# EAGLE design MI0283QT_v20 (EAGLE 6.6.0)
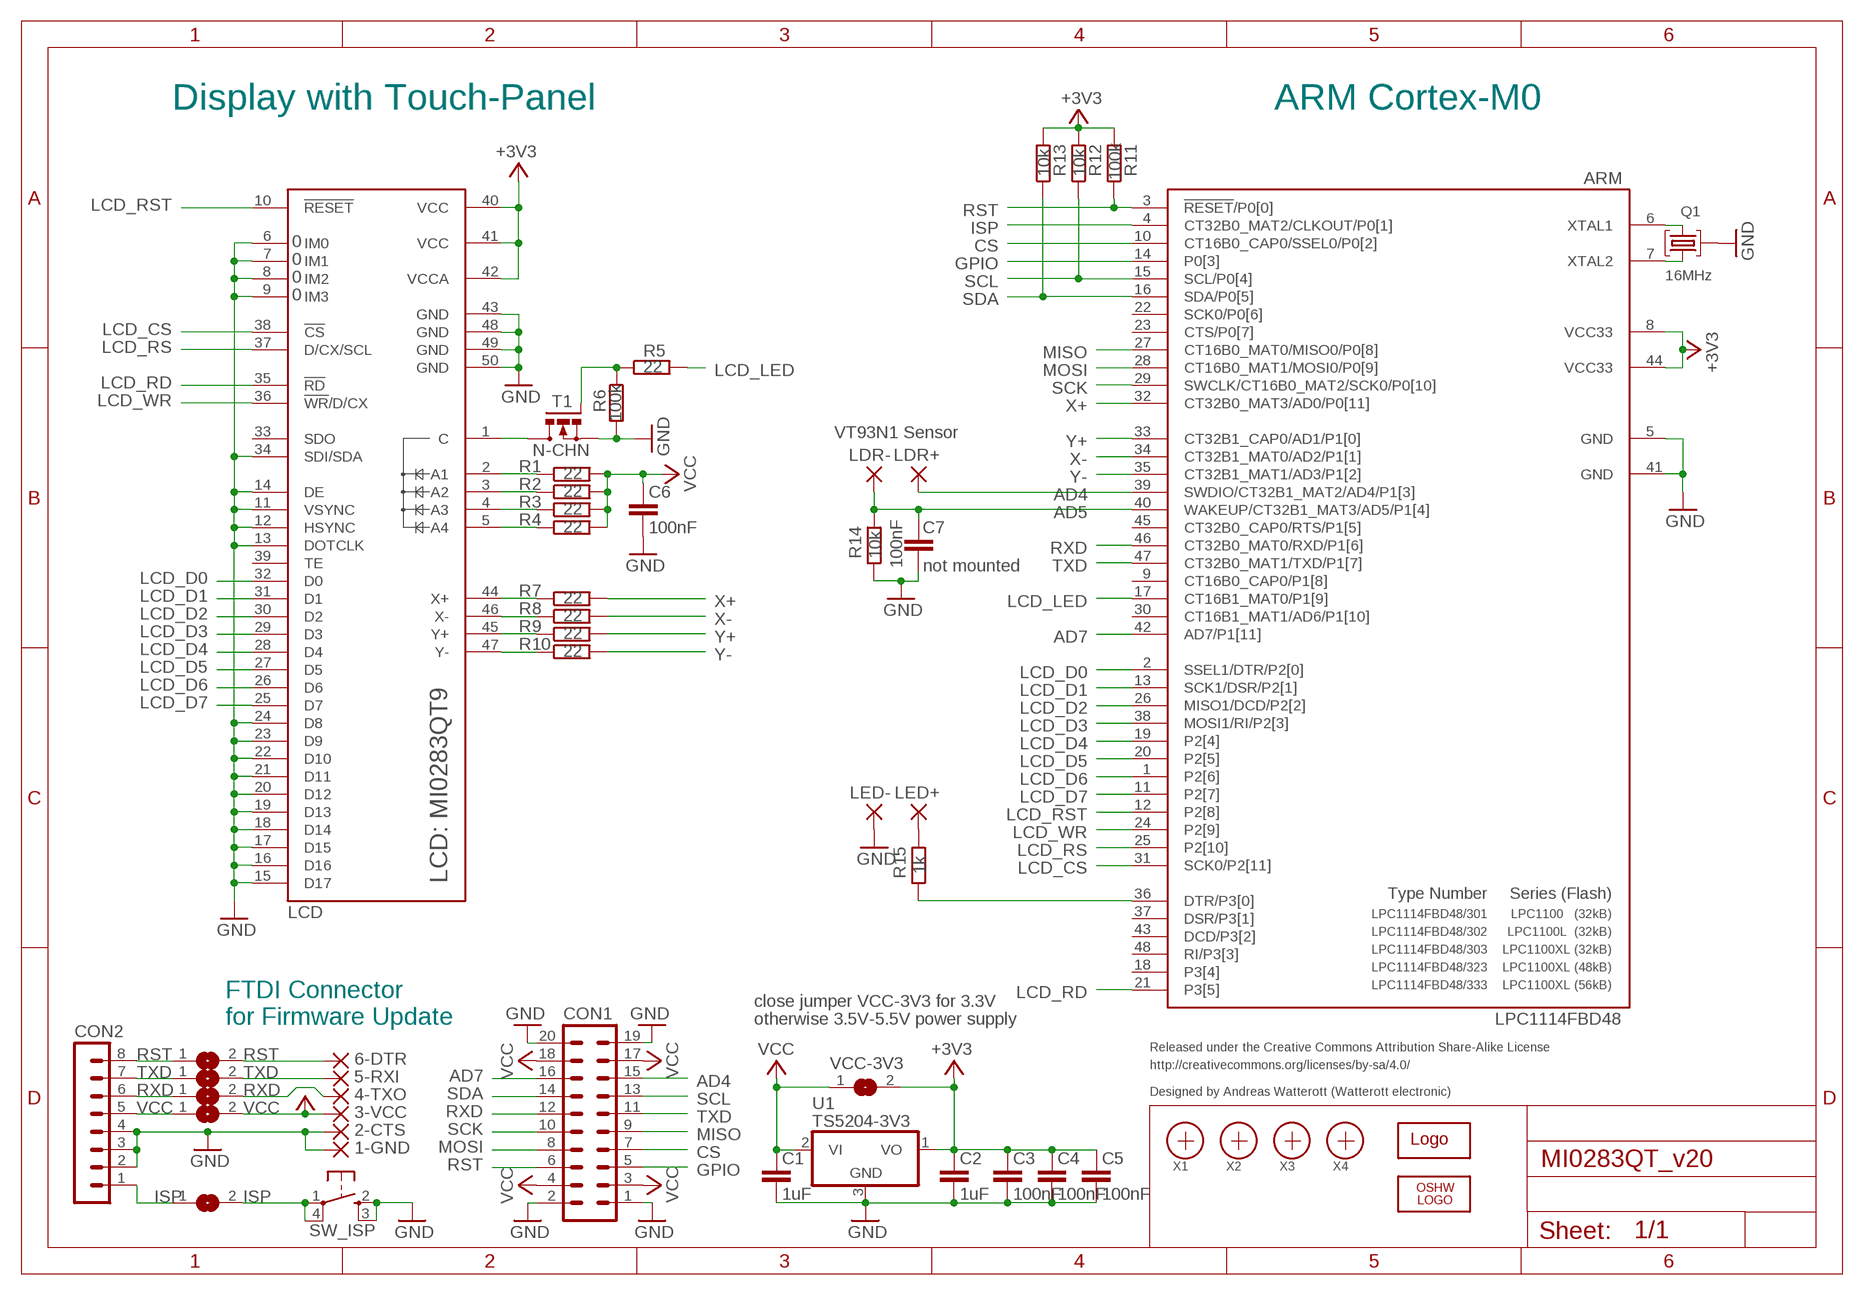
[diagram p0: schematic, sheet 1]

## Parts
1-GND  WIREPADSMD1,27-254  [SMD1,27-2,54]
2-CTS  WIREPADSMD1,27-254  [SMD1,27-2,54]
3-VCC  WIREPADSMD1,27-254  [SMD1,27-2,54]
4-TXO  WIREPADSMD1,27-254  [SMD1,27-2,54]
5-RXI  WIREPADSMD1,27-254  [SMD1,27-2,54]
6-DTR  WIREPADSMD1,27-254  [SMD1,27-2,54]
ARM  LPC1114FBD48  LPC111X  [LQFP48]
C1  1uF  C-EUC0603  [C0603]
C2  1uF  C-EUC0603  [C0603]
C3  100nF  C-EUC0603  [C0603]
C4  100nF  C-EUC0603  [C0603]
C5  100nF  C-EUC0603  [C0603]
C6  100nF  C-EUC0603  [C0603]
C7  100nF  C-EUC0603  [C0603]
CON1  MA10-2  [MA10-2]
CON2  MA08-1  [MA08-1]
ISP  SJ  [SJ]
LCD  MI0283QT9  [MI0283QT9]
LDR+  WIREPAD2,15/1,0  [2,15/1,0]
LDR-  WIREPAD2,15/1,0  [2,15/1,0]
LED+  WIREPAD2,15/1,0  [2,15/1,0]
LED-  WIREPAD2,15/1,0  [2,15/1,0]
LOGO1  OSHW_LOGO_6MILX0150-NT  [OSHW_6X150_NOTEXT]
Q1  16MHz  SMD_OSC2  [SMD_OSC_35X15]
R1  22  R-EU_R0603  [R0603]
R2  22  R-EU_R0603  [R0603]
R3  22  R-EU_R0603  [R0603]
R4  22  R-EU_R0603  [R0603]
R5  22  R-EU_R0603  [R0603]
R6  100k  R-EU_R0603  [R0603]
R7  22  R-EU_R0603  [R0603]
R8  22  R-EU_R0603  [R0603]
R9  22  R-EU_R0603  [R0603]
R10  22  R-EU_R0603  [R0603]
R11  100k  R-EU_R0603  [R0603]
R12  10k  R-EU_R0603  [R0603]
R13  10k  R-EU_R0603  [R0603]
R14  10k  R-EU_R0603  [R0603]
R15  1k  R-EU_R0603  [R0603]
RST  SJ  [SJ]
RXD  SJ  [SJ]
SW_ISP  SW_SMDS  [SW_SMD4@1]
T1  N-CHN  IRLML2502  [MICRO3]
TXD  SJ  [SJ]
U1  TS5204-3V3  TS5204  [SOT23]
U$1  WE-LOGO  WE-LOGOPLACE  [WE-LOGO]
VCC  SJ  [SJ]
VCC-3V3  SJ  [SJ]
X1  PASSER  [PASSER]
X2  PASSER  [PASSER]
X3  PASSER  [PASSER]
X4  PASSER  [PASSER]

## Nets
+3V3: ARM.8(VCC33) ARM.44(VCC33) C2.1 C3.1 C4.1 C5.1 LCD.40(VCC) LCD.41(VCC) LCD.42(VCCA) R11.2 R12.2 R13.2 U1.1(VO) VCC-3V3.2
AD4: ARM.39(SWDIO/CT32B1_MAT2/AD4/P1[3]) CON1.15 LDR+.1(P)
AD5: ARM.40(WAKEUP/CT32B1_MAT3/AD5/P1[4]) C7.1 LDR-.1(P) R14.2
AD7: ARM.42(AD7/P1[11]) CON1.16
C: LCD.1(C) T1.3(D)
C_ISP: CON2.1 ISP.1
C_RST: CON2.8 RST.1
C_RXD: CON2.6 RXD.1
C_TXD: CON2.7 TXD.1
C_VCC: CON2.5 VCC.1
CS: ARM.10(CT16B0_CAP0/SSEL0/P0[2]) CON1.7
GND: 1-GND.1(P) 2-CTS.1(P) ARM.5(GND) ARM.41(GND) C1.2 C2.2 C3.2 C4.2 C5.2 C6.2 C7.2 CON1.1 CON1.2 CON1.19 CON1.20 CON2.2 CON2.3 CON2.4 LCD.6(IM0) LCD.7(IM1) LCD.8(IM2) LCD.9(IM3) LCD.11(VSYNC) LCD.12(HSYNC) LCD.13(DOTCLK) LCD.14(DE) LCD.15(D17) LCD.16(D16) LCD.17(D15) LCD.18(D14) LCD.19(D13) LCD.20(D12) LCD.21(D11) LCD.22(D10) LCD.23(D9) LCD.24(D8) LCD.34(SDI/SDA) LCD.43(GND) LCD.48(GND) LCD.49(GND) LCD.50(GND) LED-.1(P) Q1.GND R6.2 R14.1 SW_ISP.2(S) SW_ISP.3(S1) T1.2(S) U1.3(GND)
GPIO: ARM.14(P0[3]) CON1.5
ISP: ARM.4(CT32B0_MAT2/CLKOUT/P0[1]) ISP.2 SW_ISP.1(P) SW_ISP.4(P1)
LCD_CS: ARM.31(SCK0/P2[11]) LCD.38(!CS)
LCD_D0: ARM.2(SSEL1/DTR/P2[0]) LCD.32(D0)
LCD_D1: ARM.13(SCK1/DSR/P2[1]) LCD.31(D1)
LCD_D2: ARM.26(MISO1/DCD/P2[2]) LCD.30(D2)
LCD_D3: ARM.38(MOSI1/RI/P2[3]) LCD.29(D3)
LCD_D4: ARM.19(P2[4]) LCD.28(D4)
LCD_D5: ARM.20(P2[5]) LCD.27(D5)
LCD_D6: ARM.1(P2[6]) LCD.26(D6)
LCD_D7: ARM.11(P2[7]) LCD.25(D7)
LCD_LED: ARM.17(CT16B1_MAT0/P1[9]) R5.2
LCD_RD: ARM.21(P3[5]) LCD.35(!RD)
LCD_RS: ARM.25(P2[10]) LCD.37(D/CX/SCL)
LCD_RST: ARM.12(P2[8]) LCD.10(!RESET)
LCD_WR: ARM.24(P2[9]) LCD.36(!WR!/D/CX)
LED: ARM.36(DTR/P3[0]) R15.1
LED_A1: LCD.2(A1) R1.1
LED_A2: LCD.3(A2) R2.1
LED_A3: LCD.4(A3) R3.1
LED_A4: LCD.5(A4) R4.1
LEDPWM: R5.1 R6.1 T1.1(G)
MISO: ARM.27(CT16B0_MAT0/MISO0/P0[8]) CON1.9
MOSI: ARM.28(CT16B0_MAT1/MOSI0/P0[9]) CON1.8
N$1: ARM.6(XTAL1) Q1.2
N$2: ARM.7(XTAL2) Q1.1
N$8: LED+.1(P) R15.2
RST: 6-DTR.1(P) ARM.3(!RESET!/P0[0]) CON1.6 R11.1 RST.2
RXD: 4-TXO.1(P) ARM.46(CT32B0_MAT0/RXD/P1[6]) CON1.12 RXD.2
SCK: ARM.29(SWCLK/CT16B0_MAT2/SCK0/P0[10]) CON1.10
SCL: ARM.15(SCL/P0[4]) CON1.13 R12.1
SDA: ARM.16(SDA/P0[5]) CON1.14 R13.1
TXD: 5-RXI.1(P) ARM.47(CT32B0_MAT1/TXD/P1[7]) CON1.11 TXD.2
VCC: 3-VCC.1(P) C1.1 C6.1 CON1.3 CON1.4 CON1.17 CON1.18 R1.2 R2.2 R3.2 R4.2 U1.2(VI) VCC-3V3.1 VCC.2
X+: ARM.32(CT32B0_MAT3/AD0/P0[11]) R7.2
X-: ARM.34(CT32B1_MAT0/AD2/P1[1]) R8.2
XM: LCD.46(X-) R8.1
XP: LCD.44(X+) R7.1
Y+: ARM.33(CT32B1_CAP0/AD1/P1[0]) R9.2
Y-: ARM.35(CT32B1_MAT1/AD3/P1[2]) R10.2
YM: LCD.47(Y-) R10.1
YP: LCD.45(Y+) R9.1
Unconnected: ARM.9(CT16B0_CAP0/P1[8]) ARM.18(P3[4]) ARM.22(SCK0/P0[6]) ARM.23(CTS/P0[7]) ARM.30(CT16B1_MAT1/AD6/P1[10]) ARM.37(DSR/P3[1]) ARM.43(DCD/P3[2]) ARM.45(CT32B0_CAP0/RTS/P1[5]) ARM.48(RI/P3[3]) LCD.33(SDO) LCD.39(TE)

## Notes on the sheet
- Display with Touch-Panel | ARM Cortex-M0
- 0
- 0
- 0
- 0
- VT93N1 Sensor
- not mounted
- Type Number | Series (Flash)
- LPC1114FBD48/301 | LPC1100   (32kB)
- LPC1114FBD48/302 | LPC1100L  (32kB)
- LPC1114FBD48/303 | LPC1100XL (32kB)
- LPC1114FBD48/323 | LPC1100XL (48kB)
- LPC1114FBD48/333 | LPC1100XL (56kB)
- FTDI Connector
- close jumper VCC-3V3 for 3.3V
- for Firmware Update | otherwise 3.5V-5.5V power supply
- Released under the Creative Commons Attribution Share-Alike License
- http://creativecommons.org/licenses/by-sa/4.0/
- Designed by Andreas Watterott (Watterott electronic)

## Library data of the parts
1-GND 2-CTS 3-VCC 4-TXO 5-RXI 6-DTR LDR+ LDR- LED+ LED- = wirepad:WIREPAD: Wire PAD connect wire on PCB
ARM = ARM:LPC111X: NXP LPC1113/14
C1-C7 = rcl:C-EU: CAPACITOR, European symbol
CON1 = con-lstb:MA10-2: PIN HEADER; OC_FARNELL: unknown; OC_NEWARK: unknown
CON2 = con-lstb:MA08-1: PIN HEADER; OC_FARNELL: unknown; OC_NEWARK: unknown
ISP RST RXD TXD VCC VCC-3V3 = jumper:SJ: SMD solder JUMPER
LCD = Display:MI0283QT9: Multi-Inno MIO283QT9 LCD (240x320) with Ilitek ILI9341 controller
LOGO1 = OSHW:OSHW_LOGO_6MIL
Q1 = Crystal:SMD_OSC
R1-R15 = rcl:R-EU_: RESISTOR, European symbol
SW_ISP = Switch-SMD:SW_SMD
T1 = IRF-sot23:IRLML2502: N-Channel Power MOSFET
U1 = Voltage-Reg:TS5204
U$1 = welectronic:WE-LOGO
X1-X4 = SMD:PASSER

## Board
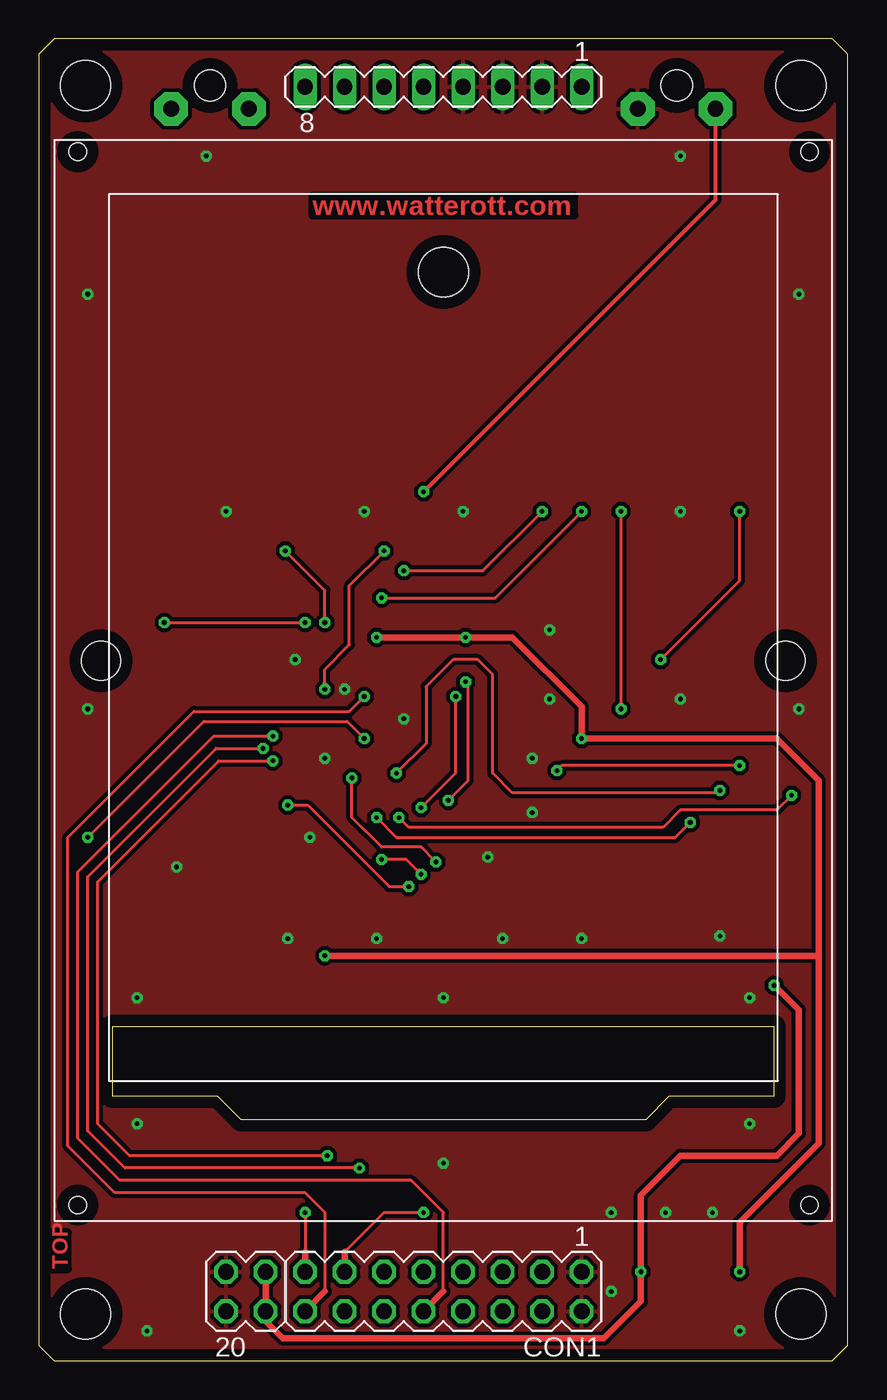
[diagram p1: board, top side]
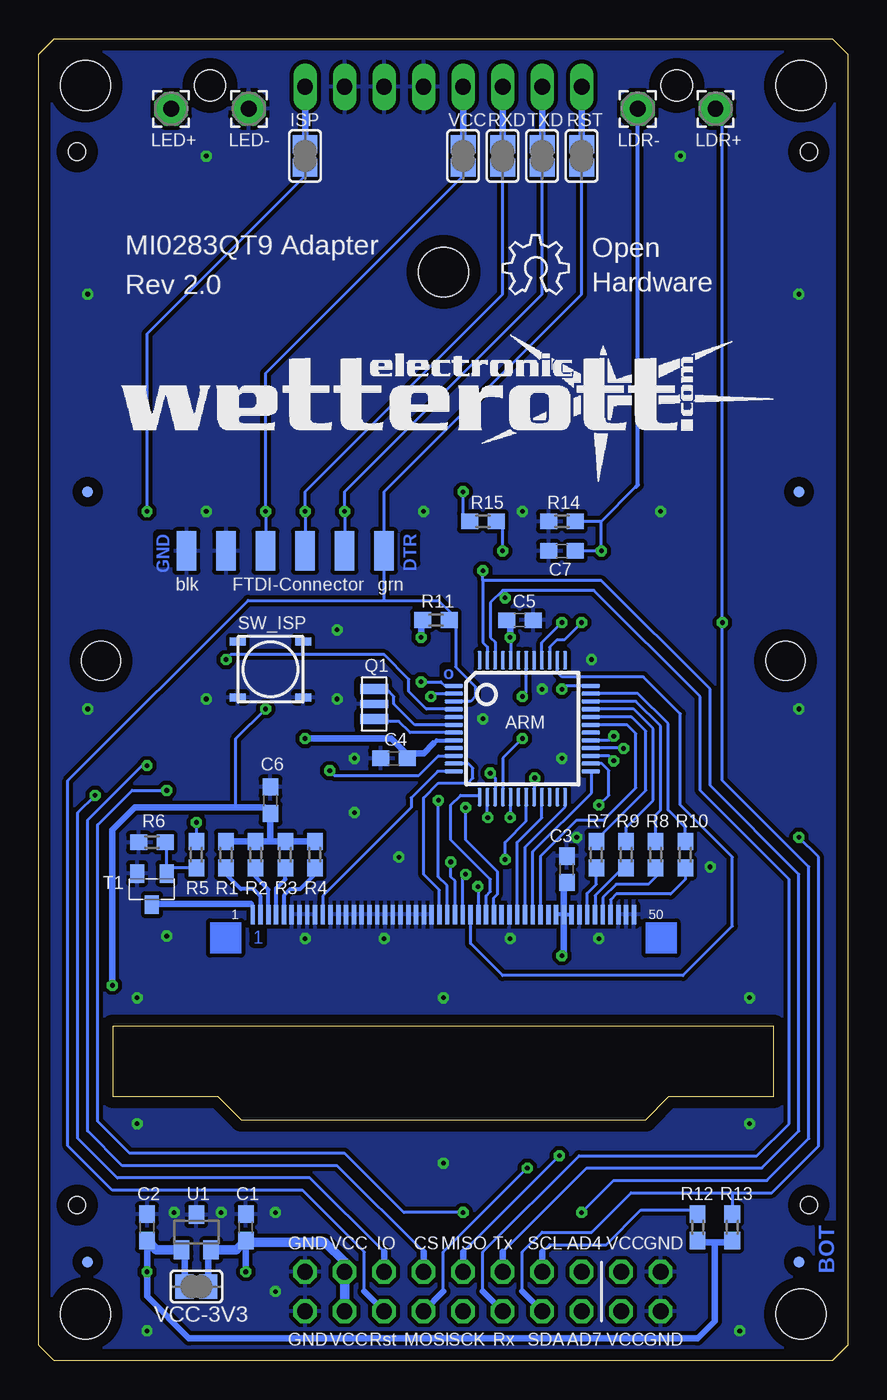
[diagram p2: board, bottom side, seen from below]

Size 52 x 85 mm. Coordinates in mm from the lower left corner, seen from the top.
Outline: 0,1 1,0 51,0 52,1 52,84 51,85 1,85 0,84 0,1
Copper layers (1*16): Top 0.035mm / dielectric 1.5mm / Bottom 0.035mm
Design rules "default *": minimum track width 8mil, minimum drill 0.3mm, track to track 8mil, track to pad 8mil, pad to pad 8mil, via to via 8mil, smd to smd 8mil, copper to edge 30mil, drill to drill 8mil, minimum pad ring 10mil, minimum via ring 8mil, stop-mask expansion 4mil, vias tented up to drill 0.5mm, thermal gap 10mil
Holes 3.2 mm at 3,3 49,3 3,82 49,82 26,70
Holes 2 mm at 41,82 11,82
Holes 2.5 mm at 4,45 48,45
bRestrict: area 29.7,42.9 to 31.4,43.7; area 29.7,40.8 to 31.4,41.6

### Footprints (pad centres in the part's own frame; a part is rotated, then mirrored left to right if it is on the bottom)
SMD1,27-2,54 = smd 1.27 x 2.54: 1 0,0
LQFP48 = smd 1.2 x 0.26: 1 -4.4,2.75; 2 -4.4,2.25; 3 -4.4,1.75; 4 -4.4,1.25; 5 -4.4,0.75; 6 -4.4,0.25; 7 -4.4,-0.25; 8 -4.4,-0.75; 9 -4.4,-1.25; 10 -4.4,-1.75; 11 -4.4,-2.25; 12 -4.4,-2.75; 25 4.4,-2.75; 26 4.4,-2.25; 27 4.4,-1.75; 28 4.4,-1.25; 29 4.4,-0.75; 30 4.4,-0.25; 31 4.4,0.25; 32 4.4,0.75; 33 4.4,1.25; 34 4.4,1.75; 35 4.4,2.25; 36 4.4,2.75 | smd 0.26 x 1.2: 13 -2.75,-4.4; 14 -2.25,-4.4; 15 -1.75,-4.4; 16 -1.25,-4.4; 17 -0.75,-4.4; 18 -0.25,-4.4; 19 0.25,-4.4; 20 0.75,-4.4; 21 1.25,-4.4; 22 1.75,-4.4; 23 2.25,-4.4; 24 2.75,-4.4; 37 2.75,4.4; 38 2.25,4.4; 39 1.75,4.4; 40 1.25,4.4; 41 0.75,4.4; 42 0.25,4.4; 43 -0.25,4.4; 44 -0.75,4.4; 45 -1.25,4.4; 46 -1.75,4.4; 47 -2.25,4.4; 48 -2.75,4.4
C0603 = smd 1.1 x 1: 1 -0.85,0; 2 0.85,0
MA10-2 = drill 1.016 octagon: 1 -11.43,-1.27; 2 -11.43,1.27; 3 -8.89,-1.27; 4 -8.89,1.27; 5 -6.35,-1.27; 6 -6.35,1.27; 7 -3.81,-1.27; 8 -3.81,1.27; 9 -1.27,-1.27; 10 -1.27,1.27; 11 1.27,-1.27; 12 1.27,1.27; 13 3.81,-1.27; 14 3.81,1.27; 15 6.35,-1.27; 16 6.35,1.27; 17 8.89,-1.27; 18 8.89,1.27; 19 11.43,-1.27; 20 11.43,1.27
MA08-1 = drill 1.016 long: 1 -8.89,0; 2 -6.35,0; 3 -3.81,0; 4 -1.27,0; 5 1.27,0; 6 3.81,0; 7 6.35,0; 8 8.89,0
SJ = smd 1.168 x 1.6: 1 -0.762,0; 2 0.762,0
MI0283QT9 = smd 0.279 x 1.27 bottom: 1 12.25,19.683; 2 11.75,19.683; 3 11.25,19.683; 4 10.75,19.683; 5 10.25,19.683; 6 9.75,19.683; 7 9.25,19.683; 8 8.75,19.683; 9 8.25,19.683; 10 7.75,19.683; 11 7.25,19.683; 12 6.75,19.683; 13 6.25,19.683; 14 5.75,19.683; 15 5.25,19.683; 16 4.75,19.683; 17 4.25,19.683; 18 3.75,19.683; 19 3.25,19.683; 20 2.75,19.683; 21 2.25,19.683; 22 1.75,19.683; 23 1.25,19.683; 24 0.75,19.683; 25 0.25,19.683; 26 -0.25,19.683; 27 -0.75,19.683; 28 -1.25,19.683; 29 -1.75,19.683; 30 -2.25,19.683; 31 -2.75,19.683; 32 -3.25,19.683; 33 -3.75,19.683; 34 -4.25,19.683; 35 -4.75,19.683; 36 -5.25,19.683; 37 -5.75,19.683; 38 -6.25,19.683; 39 -6.75,19.683; 40 -7.25,19.683; 41 -7.75,19.683; 42 -8.25,19.683; 43 -8.75,19.683; 44 -9.25,19.683; 45 -9.75,19.683; 46 -10.25,19.683; 47 -10.75,19.683; 48 -11.25,19.683; 49 -11.75,19.683; 50 -12.25,19.683 | hole 1.1: 23.54,1; -23.5,1; 23.54,68.75; -23.5,68.75
2,15/1,0 = drill 1.016 pad 2.159 octagon: 1 0,0
SMD_OSC_35X15 = smd 0.635 x 1.778: 1 -0.965,0; 2 0.965,0 | smd 0.508 x 1.778: GND 0,0
R0603 = smd 1.1 x 1: 1 -0.85,0; 2 0.85,0
SW_SMD4@1 = smd 0.508 x 1.016: 1 -1.8,-2.1; 2 1.8,-2.1; 3 1.8,2.1; 4 -1.8,2.1
MICRO3 = smd 0.9 x 1.2: 1 -0.95,-1; 2 0.95,-1; 3 0,1
SOT23 = smd 1 x 1.2: 1 -0.95,-1.132; 2 0.95,-1.132; 3 0,1.132
PASSER = smd 0.7 x 0.7: X 0,0

### Placement (x,y rotation side)
1-GND  42.51,52.07 0 bottom
2-CTS  39.97,52.07 0 bottom
3-VCC  37.43,52.07 0 bottom
4-TXO  34.89,52.07 0 bottom
5-RXI  32.35,52.07 0 bottom
6-DTR  29.81,52.07 0 bottom
ARM  20.92,40.64 0 bottom
C1  38.7,8.57 90 bottom
C2  45.05,8.57 90 bottom
C3  18.06,31.59 90 bottom
C4  29.18,38.73 180 bottom
C5  21.08,47.62 0 bottom
C6  37.11,36.04 90 bottom
C7  18.38,52.07 180 bottom
CON1  23.46,4.45 180 top
CON2  26,81.92 180 top
ISP  34.89,77.47 270 bottom
LCD  26,9 0 top
LDR+  8.5,80.5 0 bottom
LDR-  13.5,80.5 0 bottom
LED+  43.5,80.5 0 bottom
LED-  38.5,80.5 0 bottom
LOGO1  22.19,68.58 0 bottom
Q1  30.45,42.23 90 bottom
R1  39.97,32.54 90 bottom
R2  38.06,32.54 90 bottom
R3  36.16,32.54 90 bottom
R4  34.26,32.54 90 bottom
R5  41.88,32.54 90 bottom
R6  44.73,33.34 180 bottom
R7  16.16,32.54 90 bottom
R8  12.35,32.54 90 bottom
R9  14.25,32.54 90 bottom
R10  10.44,32.54 90 bottom
R11  26.48,47.63 180 bottom
R12  9.65,8.57 270 bottom
R13  7.43,8.57 270 bottom
R14  18.38,53.98 0 bottom
R15  23.46,53.98 180 bottom
RST  17.11,77.47 270 bottom
RXD  22.19,77.47 270 bottom
SW_ISP  37.11,44.45 270 bottom
T1  44.73,30.32 180 bottom
TXD  19.65,77.47 270 bottom
U1  41.88,8.26 0 bottom
U$1  46.95,56.2 0 bottom
VCC  24.73,77.47 270 bottom
VCC-3V3  41.88,4.76 180 bottom
X1  3.14,6.35 0 bottom
X2  3.14,55.88 0 bottom
X3  48.86,55.88 0 bottom
X4  48.86,6.35 0 bottom

### Tracks (layer width: path | path; a pad name or v marks a point on that pad's centre or on a via)
+3V3  (via drill 0.3)
  Top 0.406: v45.05,5.71 45.05,8.89 50.13,13.97 50.13,26.04 | v21.71,46.51 v27.43,46.51 30.45,46.51 34.89,42.07 v34.89,40.01 | 50.13,26.04 v18.38,26.04 | 50.13,26.04 50.13,37.31 47.43,40.01 v34.89,40.01 | v34.89,40.01
  Bottom 0.203: 45.03,7.12 45.05,7.14 C2.1 | 28.38,38.73 C4.1 | 21.67,46.47 ARM.44 | 21.71,47.41 C5.1
  Bottom 0.254: LCD.42 LCD.41 LCD.40 | ARM.8 26.43,39.89 26.64,39.69
  Bottom 0.406: 42.64,6.93 VCC-3V3.2 | 45.05,7.14 v45.05,5.71 45.05,4.13 42.35,1.43 9.65,1.43 8.54,2.54 8.54,7.62 | 28.38,39.05 28.38,38.73 | 28.38,39.05 29.33,40.01 v34.89,40.01 | 28.38,39.05 27.27,39.05 26.64,39.69 | v18.38,26.04 18.25,26.16 LCD.41 18.25,30.55 C3.1 | 21.67,46.47 v21.71,46.51 21.71,47.41 | 8.54,7.62 7.53,7.62 R13.2 | 8.54,7.62 9.55,7.62 R12.2 | v27.43,46.51 27.43,47.52 R11.2 | v34.89,40.01
  Bottom 0.61: 42.64,6.93 U1.1 44.45,7.12 C2.1
AD4  (via drill 0.3)
  Top 0.203: v17.11,9.53 17.11,6.99 | v8.06,47.47 v17.11,47.47
  Top 0.406: 17.11,6.99 CON1.15
  Bottom 0.203: ARM.39 19.17,45.88 18.7,46.35 18.22,46.35 v17.11,47.47 | v17.11,9.53 15.05,11.59 5.2,11.59 2.5,14.29 2.5,31.75 | 2.5,31.75 | LDR+.1 8.06,80.06 v8.06,47.47 8.06,37.31 2.5,31.75 | 2.5,31.75
AD5  (via drill 0.3)
  Top 0.203: v18.38,47.47 18.38,49.53 v15.84,52.07
  Bottom 0.203: 15.84,53.98 v15.84,52.07 C7.1 | 15.84,53.98 13.62,56.2 | 15.84,53.98 R14.2 | ARM.40 19.67,46.18 v18.38,47.47 | v18.38,47.47
  Bottom 0.254: 13.62,56.2 13.5,56.31 LDR-.1
AD7  (via drill 0.3)
  Top 0.203: 18.38,4.45 18.38,9.53 17.11,10.79 4.89,10.79 1.87,13.81 1.87,33.66 9.97,41.75 19.97,41.75 v20.92,42.7
  Top 0.406: CON1.16 | 18.38,4.45 CON1.16
  Bottom 0.203: ARM.42 20.67,42.95 v20.92,42.7
C
  Bottom 0.254: LCD.1 38.25,29.24 38.38,29.37
  Bottom 0.406: 38.38,29.37 44.69,29.37 T1.3
C_ISP
  Bottom 0.203: ISP.1
  Bottom 0.406: ISP.1 CON2.1
C_RST
  Bottom 0.406: RST.1 CON2.8
C_RXD
  Bottom 0.406: RXD.1 CON2.6
C_TXD
  Bottom 0.203: CON2.7
  Bottom 0.406: TXD.1 CON2.7
C_VCC
  Bottom 0.406: VCC.1 CON2.5
CS  (via drill 0.3)
  Top 0.203: v33.3,37.94 33.62,38.26 v45.05,38.26
  Bottom 0.203: ARM.10 26.32,38.89 27.59,37.62 32.98,37.62 v33.3,37.94 | 27.27,6.99 32.83,12.54 46.64,12.54 48.86,14.76 48.86,34.77 45.37,38.26 v45.05,38.26
  Bottom 0.406: CON1.7 27.27,6.99
GND  (via drill 0.3)
  other vias: 3.14,41.91 48.86,41.91 10.76,77.47 41.24,77.47 29.81,27.15 34.89,27.15 19.65,43.18 23.46,41.28 6.95,1.91 45.05,1.91 40.29,9.53 43.3,9.53 18.38,38.74 31.71,38.74 16,27.15 21.71,27.15 17.43,33.66 28.86,32.38 36.8,4.45 36.8,9.53 6.32,15.24 45.69,15.24 26,12.7 6.32,23.34 26,23.34 45.69,23.34 43.78,27.3 32.83,42.55 41.24,42.55 8.86,31.75 16.48,45.08 3.14,68.58 48.86,68.58 41.24,54.61 12.03,54.61 31.71,35.24 20.92,54.61 27.27,54.61 32.83,46.99
  pour Bottom (isolate 0.254): 0,85 52,85 52,0 0,0
  pour Top (isolate 0.254): 0,85 52,85 52,0 0,0
GPIO  (via drill 0.3)
  Top 0.203: v23.14,34.92 23.78,34.29 40.13,34.29 41.24,35.4 47.43,35.4 v48.38,36.35
  Bottom 0.203: ARM.14 23.17,34.95 v23.14,34.92 | 29.81,6.99 34.57,11.75 46.95,11.75 49.5,14.29 49.5,35.24 v48.38,36.35 | v48.38,36.35
  Bottom 0.406: CON1.5 29.81,6.99
ISP  (via drill 0.3)
  Top 0.203: v45.05,54.61 45.05,50.16 v39.97,45.09
  Bottom 0.203: ARM.4 27.09,41.89 28.22,43.02 28.22,43.81 29.81,45.4 35.05,45.4 | 35.05,45.4 39.18,45.4 | v45.05,54.61 45.05,66.04 34.89,76.2 ISP.2 | ISP.2 | SW_ISP.4 35.01,46.23 35.05,46.2 35.05,45.4 | SW_ISP.1 39.21,46.23 39.18,46.2 39.18,45.4 | 39.18,45.4 39.65,45.4 v39.97,45.09
LCD_CS
  Bottom 0.203: ARM.31 14.19,40.89 13.62,40.32 13.62,36.83 15.68,34.77 17.43,34.77 19.75,32.44 LCD.38
LCD_D0  (via drill 0.3)
  Top 0.203: v26.79,42.7 | v26.79,42.7 26.79,37.78 v24.57,35.56
  Bottom 0.203: ARM.2 26.61,42.89 v26.79,42.7 | LCD.32 22.75,29.76 22.51,30 22.51,31.43 24.57,33.5 v24.57,35.56 | v24.57,35.56
LCD_D1
  Bottom 0.203: LCD.31 23.25,29.9 22.98,30.16 22.98,30.96 25.52,33.5 25.52,35.72 24.89,36.35 23.78,36.35 ARM.13
LCD_D2  (via drill 0.3)
  Top 0.203: v23.78,30.48 22.51,30.48 17.27,35.72 v16,35.72
  Bottom 0.203: ARM.26 15.81,38.39 15.36,37.94 15.36,36.35 v16,35.72 | LCD.30 23.75,30.45 v23.78,30.48
LCD_D3
  Bottom 0.203: LCD.29 24.25,26.82 22.19,24.77 10.6,24.77 7.43,27.94 7.43,32.38 10.76,35.72 10.76,41.59 13.14,43.97 18.38,43.97 18.67,44.26 ARM.38
LCD_D4  (via drill 0.3)
  Top 0.203: v22.03,32.23 23.62,32.23 v24.57,31.27
  Bottom 0.203: LCD.28 24.75,31.09 v24.57,31.27 | v22.03,32.23 22.03,33.34 20.67,34.7 ARM.19
LCD_D5  (via drill 0.3)
  Top 0.203: v25.52,32.07 24.57,33.02 22.03,33.02 20.13,34.92 v20.13,37.47 | v20.13,37.47
  Bottom 0.203: LCD.27 25.25,30.84 25.52,31.11 v25.52,32.07 | ARM.20 20.17,37.42 v20.13,37.47
LCD_D6  (via drill 0.3)
  Top 0.203: v27.43,43.66 27.59,43.5 27.59,37.31 v26.32,36.04 | v27.43,43.66
  Bottom 0.203: v26.32,36.04 26.32,31.11 25.75,30.55 LCD.26 | ARM.1 25.89,43.39 26.16,43.66 v27.43,43.66
LCD_D7
  Bottom 0.203: ARM.11 24.39,38.39 24.09,38.1 24.09,37.47 24.41,37.15 26.32,37.15 27.27,36.2 27.27,31.27 26.25,30.25 LCD.25
LCD_LED  (via drill 0.3)
  Top 0.203: v21.71,34.92 22.98,33.66 40.92,33.66 v41.88,34.61
  Bottom 0.203: ARM.17 21.67,34.97 v21.71,34.92 | 41.98,33.5 R5.2 v41.88,34.61 | v41.88,34.61
  Bottom 0.254: 41.98,33.5 41.88,33.5 | 41.88,33.5
LCD_RD
  Bottom 0.203: ARM.21 19.67,34.91 21.25,33.33 LCD.35
LCD_RS
  Bottom 0.203: ARM.25 16.48,37.84 16.48,36.51 20.25,32.74 LCD.37
LCD_RST
  Bottom 0.203: ARM.12 26.37,37.89 28.06,36.2 28.06,35.56 33.75,29.87 LCD.10
LCD_WR
  Bottom 0.203: ARM.24 18.17,35.61 20.75,33.03 LCD.36
LED  (via drill 0.3)
  Top 0.203: v18.38,43.18 18.38,44.45 19.97,46.04 19.97,49.85 v22.19,52.07
  Bottom 0.203: v22.19,52.07 22.19,53.55 R15.1 | ARM.36 18.17,43.39 v18.38,43.18
LED_A1
  Bottom 0.254: LCD.2 37.75,29.85 38.22,30.32 39.02,30.32 39.97,31.27 R1.1
LED_A2
  Bottom 0.254: LCD.3 37.25,30.3 38.06,31.11 R2.1
LED_A3
  Bottom 0.254: R3.1 36.16,30.96 36.75,30.37 LCD.4
LED_A4
  Bottom 0.254: R4.1 34.26,31.27 35.21,30.32 35.84,30.32 36.25,29.91 LCD.5
LEDPWM
  Bottom 0.203: R5.1 43.41,31.69 T1.1 43.78,33.24 R6.1
MISO  (via drill 0.3)
  Top 0.203: v18.54,13.18 5.84,13.18 3.77,15.24 3.77,30.8 11.55,38.58 v15.05,38.58 | v15.05,38.58
  Bottom 0.203: ARM.27 15.36,38.89 v15.05,38.58 | 24.73,6.99 v18.54,13.18
  Bottom 0.406: CON1.9 24.73,6.99
MOSI  (via drill 0.3)
  Top 0.203: v14.41,39.37 11.39,39.37 3.14,31.11 3.14,14.76 5.52,12.38 v20.6,12.38
  Bottom 0.203: ARM.28 14.43,39.39 v14.41,39.37 | 26,4.45 26,6.99 v20.6,12.38
  Bottom 0.406: 26,4.45 | CON1.8 26,4.45
N$1
  Bottom 0.203: ARM.6 27.84,40.89 29.18,42.23 29.18,42.7 29.65,43.18 30.43,43.18 Q1.2
N$2
  Bottom 0.203: ARM.7 28.13,40.39 28.86,41.12 30.3,41.12 Q1.1
N$8  (via drill 0.3)
  Top 0.254: v24.73,55.88 43.5,74.65 LED+.1
  Bottom 0.203: R15.2 24.73,53.98 | 24.73,53.98 | 24.73,53.98 v24.73,55.88
RST
  Bottom 0.203: 31.08,4.45 31.08,6.99 35.05,10.95 47.27,10.95 50.13,13.81 50.13,37.31 38.54,48.9 29.81,48.9 | ARM.3 24.25,42.39 23.94,42.7 23.94,43.34 25.21,44.61 25.21,47.2 R11.1 25.47,47.78 25.47,48.05 26.32,48.9 29.81,48.9 | RST.2 17.11,68.58 29.81,55.88 6-DTR.1 29.81,48.9
  Bottom 0.406: 31.08,4.45 | CON1.6 31.08,4.45
RXD  (via drill 0.3)
  Top 0.203: v22.03,49.05 29.33,49.05 v34.89,54.61
  Bottom 0.203: 3.77,15.24 3.77,30.96 9.49,36.67 9.49,42.7 16.32,49.53 22.03,49.53 | ARM.46 22.67,46.2 22.98,46.51 22.98,48.74 22.19,49.53 22.03,49.53 | 34.89,53.34 4-TXO.1 v34.89,54.61 34.89,55.88 22.19,68.58 RXD.2 | 3.77,15.24 | 3.77,15.24 5.84,13.18 17.27,13.18 23.46,6.99 23.46,4.45 | 22.03,49.53 v22.03,49.05
  Bottom 0.406: 23.46,4.45 | CON1.12 23.46,4.45
SCK  (via drill 0.3)
  Top 0.203: v15.05,40.16 11.24,40.16 2.5,31.43 2.5,14.29 5.2,11.59 23.94,11.59 26,9.53 26,4.45
  Top 0.406: CON1.10 | CON1.10 26,4.45
  Bottom 0.203: ARM.29 15.32,39.89 v15.05,40.16
SCL  (via drill 0.3)
  Top 0.203: v22.98,37.78 | v22.98,37.78 24.89,39.69 24.89,43.34 26.64,45.09 28.22,45.09 29.18,44.13 29.18,37.78 30.45,36.51 43.62,36.51 v43.78,36.67 | 19.65,6.99 22.19,9.53 v24.73,9.53
  Top 0.406: CON1.13 19.65,6.99
  Bottom 0.203: ARM.15 22.67,37.47 v22.98,37.78 | 19.65,6.99 19.17,7.46 15.52,7.46 13.3,9.68 9.91,9.68 R12.1 | v24.73,9.53 28.54,9.53 32.35,13.34 46.16,13.34 48.23,15.4 48.23,34.45 46,36.67 v43.78,36.67 | v43.78,36.67
  Bottom 0.406: CON1.13 19.65,6.99
SDA  (via drill 0.3)
  Top 0.203: v3.14,33.66 10.6,41.12 19.81,41.12 v20.92,40.01
  Bottom 0.203: v3.14,33.66 1.87,32.38 1.87,13.81 4.89,10.79 7.43,10.79 | ARM.16 22.17,38.76 v20.92,40.01 | 20.92,4.45 20.92,6.99 19.65,8.26 16.48,8.26 13.94,10.79 7.43,10.79 | 7.43,10.79 R13.1
  Bottom 0.406: 20.92,4.45 | 20.92,4.45 CON1.14
TXD  (via drill 0.3)
  Top 0.203: v23.46,50.8 28.54,50.8 v32.35,54.61
  Bottom 0.203: ARM.47 23.17,45.91 23.46,46.2 23.46,50.16 | TXD.2 19.65,68.58 32.35,55.88 v32.35,54.61 5-RXI.1 | 23.46,50.16 15.84,50.16 8.86,43.18 8.86,36.99 3.14,31.27 3.14,14.76 5.52,12.38 16.79,12.38 22.19,6.99 | 23.46,50.16 v23.46,50.8
  Bottom 0.406: CON1.11 22.19,6.99
VCC  (via drill 0.3)
  Top 0.203: v37.43,41.91 v37.43,54.61
  Top 0.406: v47.27,24.13 48.86,22.54 48.86,14.61 47.43,13.18 41.24,13.18 38.7,10.64 v38.7,5.71 38.7,3.81 36.32,1.43 15.68,1.43 14.57,2.54 CON1.18 CON1.17
  Bottom 0.203: U1.2 41.11,6.93 | v37.43,41.91 39.34,40.01 39.34,35.56 | 3-VCC.1 v37.43,54.61 37.43,63.5 24.73,76.2 VCC.2
  Bottom 0.254: 38.86,35.56 39.34,35.56 | 38.86,35.56
  Bottom 0.406: R4.2 R3.2 37.11,33.39 | 37.11,33.39 R2.2 R1.2 | 41.11,6.93 VCC-3V3.1 | C6.1 37.11,33.39 | v38.7,5.71 C1.1 | C6.1 37.17,35.24 | C6.1 37.49,35.56 38.86,35.56 45.84,35.56 47.27,34.13 v47.27,24.13
  Bottom 0.61: CON1.4 CON1.3 32.35,6.35 33.62,7.62 38.7,7.62 C1.1 39.3,7.12 U1.2
X+
  Bottom 0.203: ARM.32 13.89,41.39 12.98,40.48 12.98,36.67 16.16,33.5 R7.2
X-
  Bottom 0.203: ARM.34 13.62,42.39 12.03,40.8 12.03,35.4 12.35,35.08 R8.2
XM
  Bottom 0.203: LCD.46 15.75,29.78 14.89,30.64 12.82,30.64 12.35,31.11 R8.1
XP
  Bottom 0.203: LCD.44 16.75,30.05 16.16,30.64 R7.1
Y+
  Bottom 0.203: ARM.33 13.76,41.89 12.51,40.64 | 12.51,40.64 12.51,36.04 14.25,34.29 R9.2 | 12.51,40.64
Y-
  Bottom 0.203: ARM.35 13.49,42.89 11.55,40.96 11.55,35.4 10.44,34.29 | 10.44,34.29 | R10.2 10.44,34.29
YM
  Bottom 0.203: LCD.47 15.25,29.64 14.89,30 11.39,30 10.44,30.96 | 10.44,30.96 | R10.1 10.44,30.96
YP
  Bottom 0.203: LCD.45 16.25,29.91 14.57,31.59 14.36,31.59 R9.1

### Text on the board
Top: www.watterott.com | TOP
Bottom: DTR | GND | o | 1 | BOT
bPlace: Open | MI0283QT9 Adapter | Hardware | Rev 2.0 | grn | FTDI-Connector | blk | GND | VCC | AD4 | SCL | Tx | MISO | CS | IO | VCC | GND | GND | VCC | AD7 | SDA | Rx | SCK | MOSI | Rst | VCC | GND
Reference: Silkscreen: 22 bPlace + 26 bNames